# EAGLE design c64switchless_555 (EAGLE 6.0)
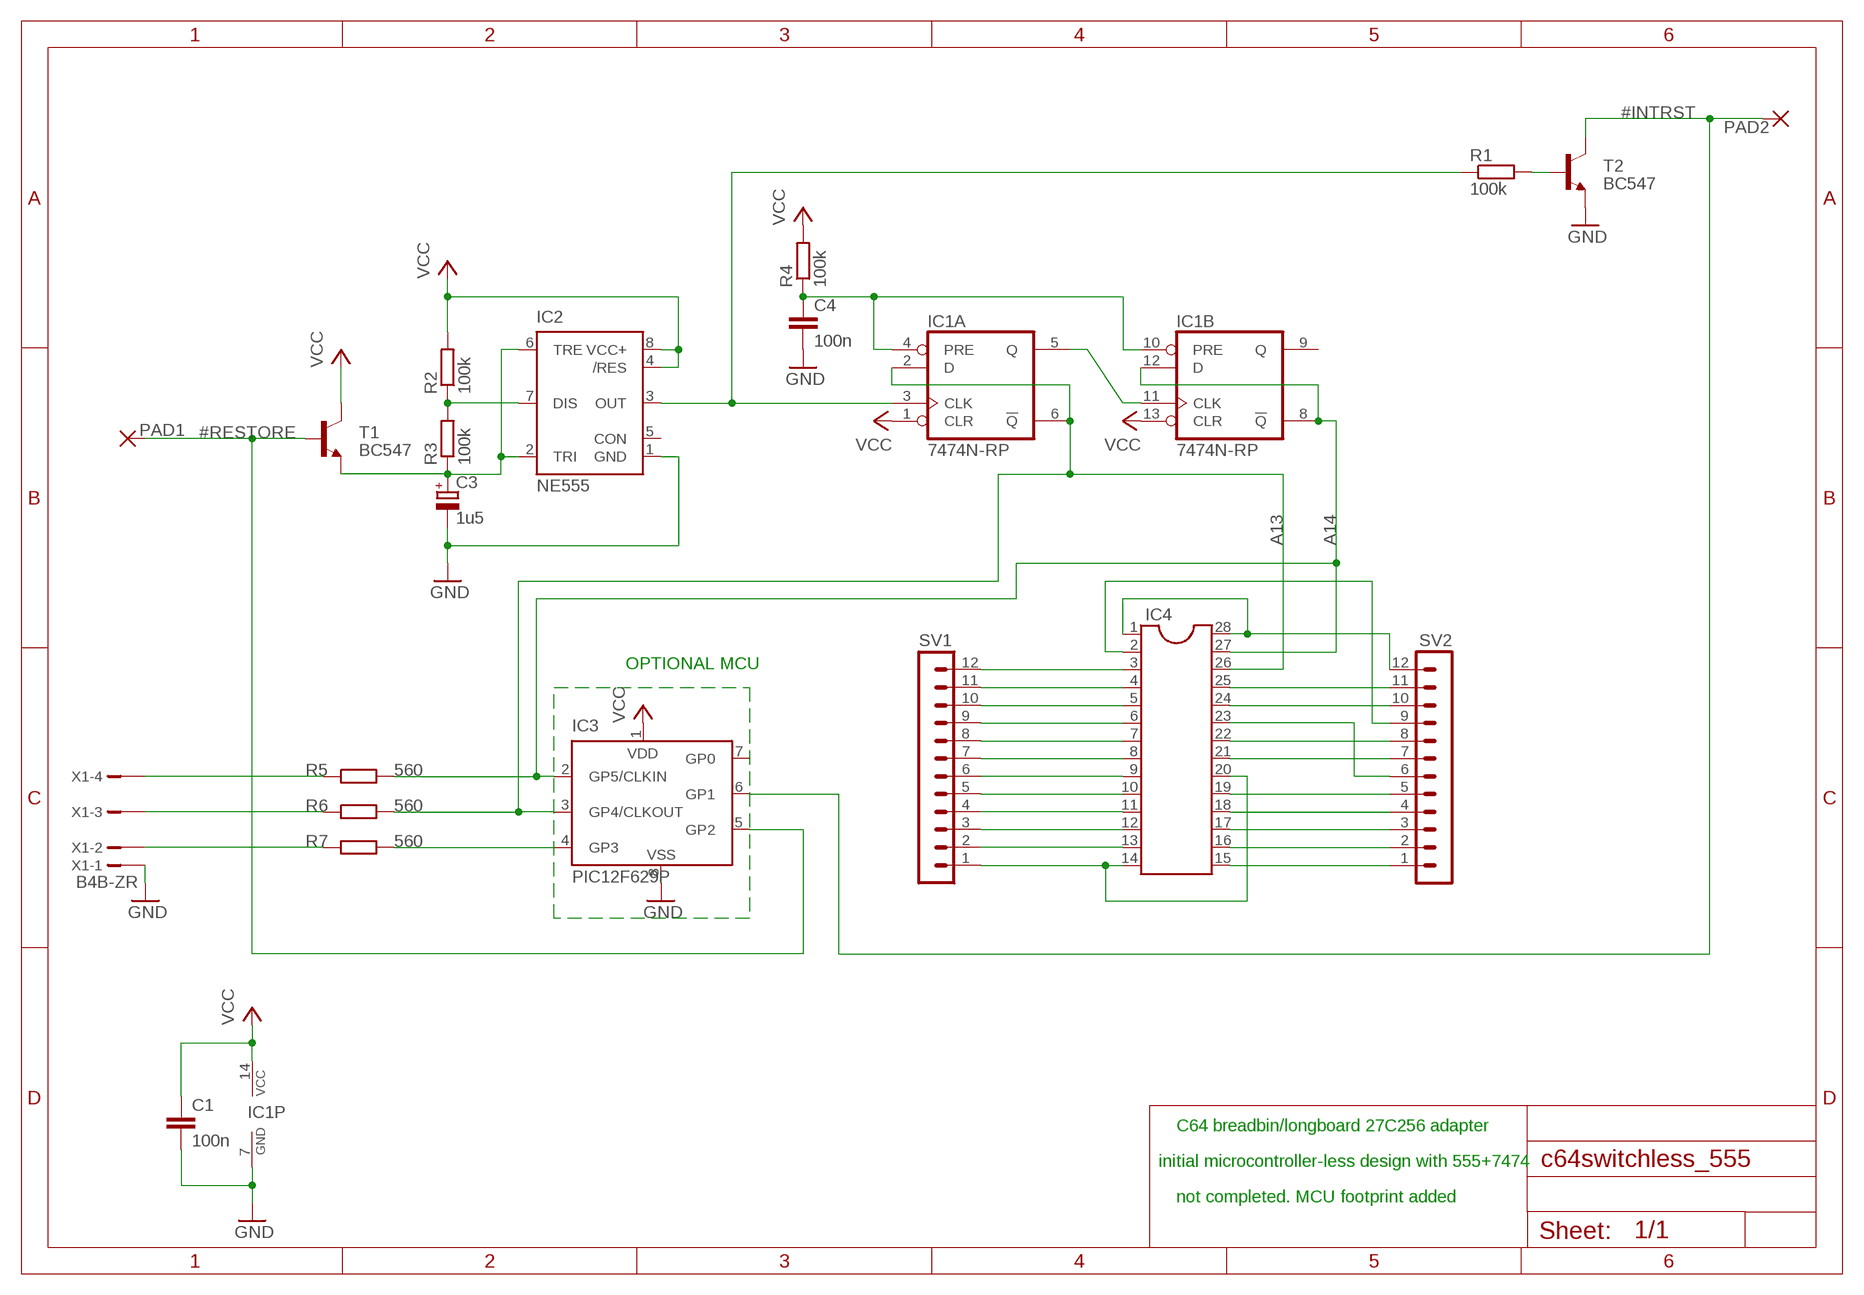
[diagram p0: schematic, sheet 1]

## Parts
C1  100n  C-EU050-030X075  [C050-030X075]
C3  1u5  CPOL-EUE2.5-6  [E2,5-6]
C4  100n  C-EU050-030X075  [C050-030X075]
IC1  7474N-RP  [DIL14-ROUNDPADS]
IC2  NE555  [DIL-08]
IC3  PIC12F629P  [DIL8]
IC4  DIL28ROUND  [DIL28SPECIAL]
PAD1  WIREPAD2,54/1,0  [2,54/1,0]
PAD2  WIREPAD2,54/1,0  [2,54/1,0]
R1  100k  R-EU_0204/7  [0204/7]
R2  100k  R-EU_0204/7  [0204/7]
R3  100k  R-EU_0204/7  [0204/7]
R4  100k  R-EU_0204/7  [0204/7]
R5  560  R-EU_0204/7  [0204/7]
R6  560  R-EU_0204/7  [0204/7]
R7  560  R-EU_0204/7  [0204/7]
SV1  MA12-1ROUND  [MA12-1ROUND]
SV2  MA12-1ROUND  [MA12-1ROUND]
T1  BC547  [TO92]
T2  BC547  [TO92]
X1  B4B-ZR  [B4B-ZR]

## Nets
#INTRST: IC3.6(GP1) PAD2.1(P) T2.3(C)
#RESTORE: IC3.5(GP2) PAD1.1(P) T1.2(B)
A13: IC1.2(A:D) IC1.6(A:!Q) IC3.3(GP4/CLKOUT) IC4.26 R6.2
A14: IC1.8(B:!Q) IC1.12(B:D) IC3.2(GP5/CLKIN) IC4.27 R5.2
GND: C1.2 C3.- C4.2 IC1.7(P:GND) IC2.1(GND) IC3.8(VSS) T2.1(E) X1.1
N$1: IC4.14 IC4.20 SV1.1
N$2: IC4.13 SV1.2
N$3: IC4.12 SV1.3
N$4: IC4.11 SV1.4
N$5: IC4.10 SV1.5
N$6: IC4.9 SV1.6
N$7: IC4.8 SV1.7
N$8: IC4.7 SV1.8
N$9: IC4.6 SV1.9
N$10: IC4.5 SV1.10
N$11: IC4.4 SV1.11
N$12: IC4.3 SV1.12
N$13: IC4.15 SV2.1
N$14: IC4.16 SV2.2
N$15: IC4.17 SV2.3
N$16: IC4.18 SV2.4
N$17: IC4.19 SV2.5
N$18: IC4.21 SV2.7
N$19: IC4.22 SV2.8
N$20: IC4.24 SV2.10
N$21: IC4.25 SV2.11
N$22: IC4.1 IC4.28 SV2.12
N$23: IC4.23 SV2.6
N$24: IC4.2 SV2.9
N$25: R1.2 T2.2(B)
N$26: C3.+ IC2.2(TRI) IC2.6(TRE) R3.1 T1.1(E)
N$27: IC2.7(DIS) R2.1 R3.2
N$28: IC3.4(GP3) R7.2
N$29: IC1.5(A:Q) IC1.11(B:CLK)
N$31: C4.1 IC1.4(A:PRE) IC1.10(B:PRE) R4.1
N$32: R5.1 X1.4
N$33: R6.1 X1.3
N$34: R7.1 X1.2
N$35: IC1.3(A:CLK) IC2.3(OUT) R1.1
VCC: C1.1 IC1.1(A:CLR) IC1.13(B:CLR) IC1.14(P:VCC) IC2.4(/RES) IC2.8(VCC+) IC3.1(VDD) R2.2 R4.2 T1.3(C)
Unconnected: IC1.9(B:Q) IC2.5(CON) IC3.7(GP0)

## Notes on the sheet
- OPTIONAL MCU
- C64 breadbin/longboard 27C256 adapter
- initial microcontroller-less design with 555+7474
- not completed. MCU footprint added

## Library data of the parts
C1 C4 = rcl:C-EU: CAPACITOR, European symbol
C3 = rcl:CPOL-EU: POLARIZED CAPACITOR, European symbol
IC1 = 74xx-eu:74*74: Dual D type positive edge triggered FLIP FLOP, preset and clear
IC2 = st-microelectronics:NE555: General purpose bipolar Timer; MF: Arrow Electronics; MPN: NE555N; OC_FARNELL: 1467742; OC_NEWARK: 89K1486
IC3 = microchip:PIC12F6*: Data Sheet 8-Pin FLASH-Based 8-Bit CMOS Microcontrollers Source: http://www.microchip.com .. 41190c.pdf; MF: MICROCHIP; MPN: PIC12F629-I/P; OC_FARNELL: 1292253; OC_NEWARK: 67K0822
IC4 = ic-package_edit:DIL28: Dual In Line
PAD1 PAD2 = wirepad:WIREPAD: Wire PAD connect wire on PCB
R1-R7 = rcl:R-EU_: RESISTOR, European symbol
SV1 SV2 = con-lstb:MA12-1: PIN HEADER
T1 T2 = transistor:BC547: NPN TRANSISTOR
X1 = con-jst:?4B-ZR: ZH CONNECTOR 1.5 mm, 4 pin 1 row Source: http://www.jst.com .. eZH.pdf; MF: FARNELL; MPN: B4B-ZR(LF)(SN); OC_FARNELL: 1830916; OC_NEWARK: 37K9960

## Board
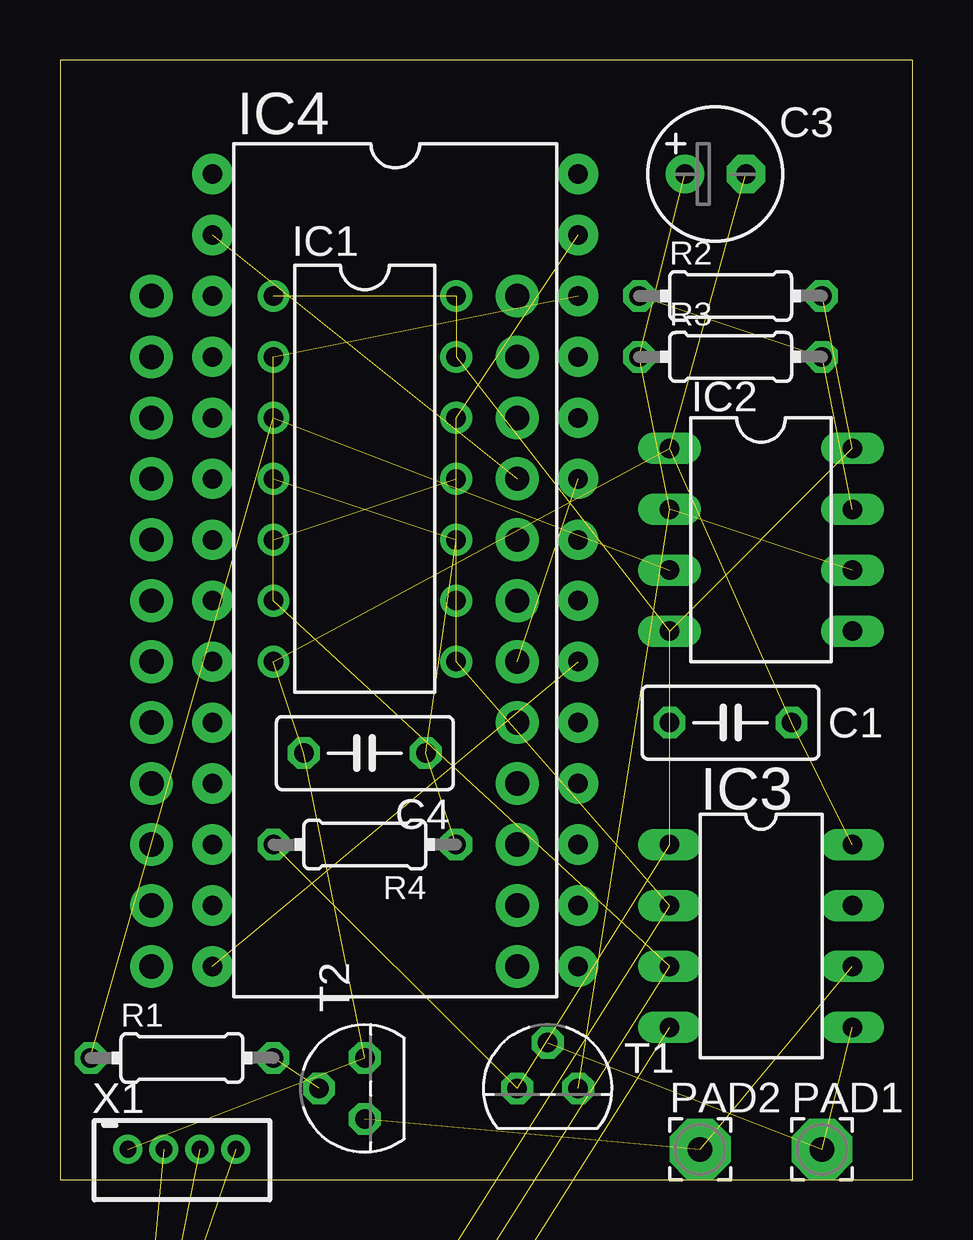
[diagram p1: board, top side]
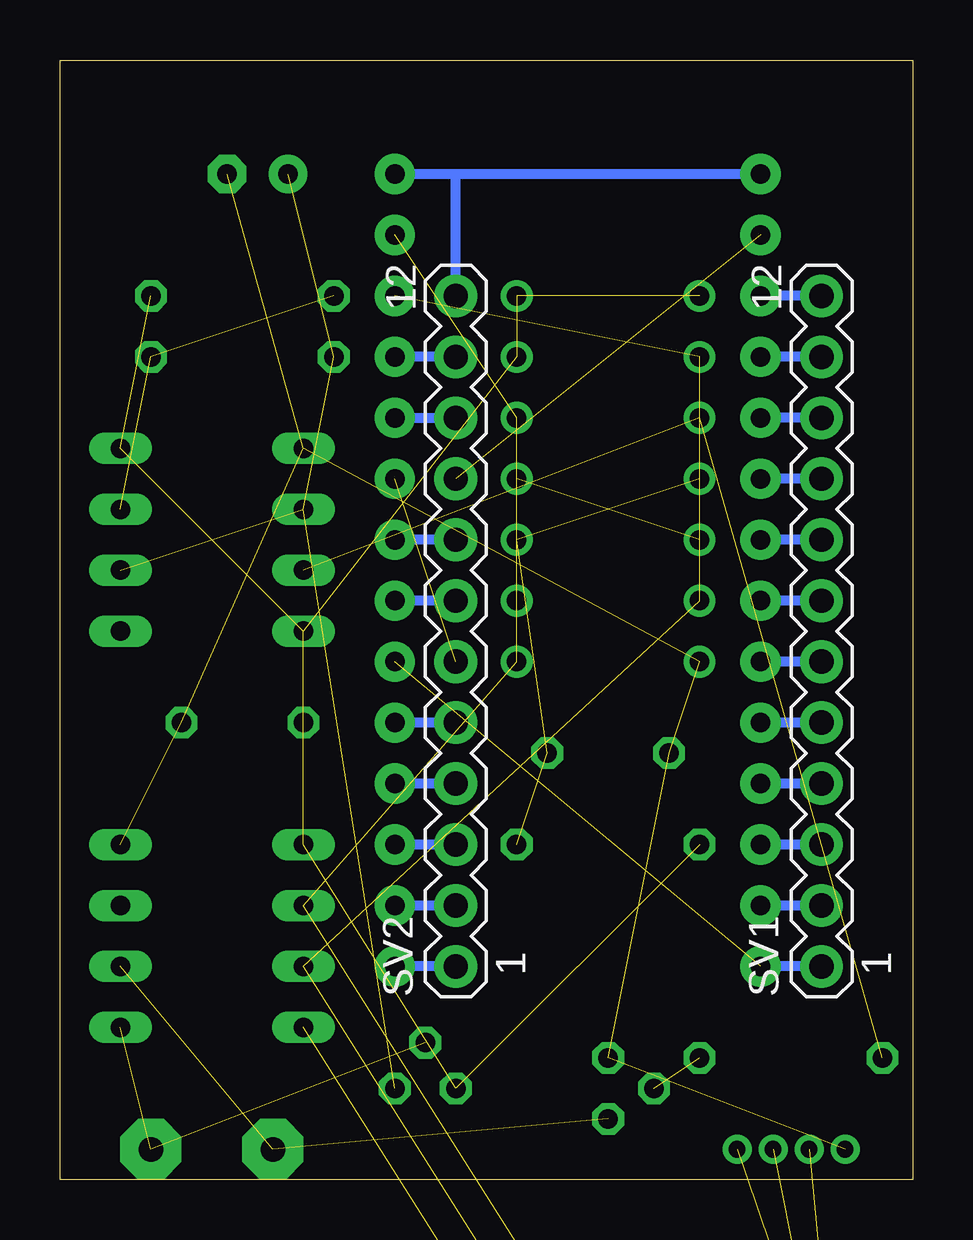
[diagram p2: board, bottom side, seen from below]

Size 35.54 x 46.66 mm. Coordinates in mm from the lower left corner, seen from the top.
Outline: 0,0 35.54,0 35.54,46.66 0,46.66 0,0
Copper layers (1*16): Top 0.035mm / dielectric 1.5mm / Bottom 0.035mm
Design rules: minimum track width 10mil, minimum drill 24mil, track to track 8mil, track to pad 8mil, pad to pad 8mil, via to via 8mil, smd to smd 8mil, copper to edge 40mil, drill to drill 8mil, minimum pad ring 10mil, minimum via ring 8mil, stop-mask expansion 4mil, vias tented up to drill 0mil, thermal gap 10mil

### Footprints (pad centres in the part's own frame; a part is rotated, then mirrored left to right if it is on the bottom)
C050-030X075 = drill 0.813 octagon: 1 -2.54,0; 2 2.54,0
E2,5-6 = drill 0.813 pad 1.6: + -1.27,0 | drill 0.813 pad 1.6 octagon: - 1.27,0
DIL14-ROUNDPADS = drill 0.813: 1 -7.62,-3.81; 2 -5.08,-3.81; 3 -2.54,-3.81; 4 0,-3.81; 5 2.54,-3.81; 6 5.08,-3.81; 7 7.62,-3.81; 8 7.62,3.81; 9 5.08,3.81; 10 2.54,3.81; 11 0,3.81; 12 -2.54,3.81; 13 -5.08,3.81; 14 -7.62,3.81
DIL-08 = drill 0.813 long: 1 -3.81,-3.81; 2 -1.27,-3.81; 3 1.27,-3.81; 4 3.81,-3.81; 5 3.81,3.81; 6 1.27,3.81; 7 -1.27,3.81; 8 -3.81,3.81
DIL8 = drill 0.813 long: 1 -3.81,-3.81; 2 -1.27,-3.81; 3 1.27,-3.81; 4 3.81,-3.81; 5 3.81,3.81; 6 1.27,3.81; 7 -1.27,3.81; 8 -3.81,3.81
DIL28SPECIAL = drill 0.813 pad 1.676: 1 -16.51,-7.62; 2 -13.97,-7.62; 3 -11.43,-7.62; 4 -8.89,-7.62; 5 -6.35,-7.62; 6 -3.81,-7.62; 7 -1.27,-7.62; 8 1.27,-7.62; 9 3.81,-7.62; 10 6.35,-7.62; 11 8.89,-7.62; 12 11.43,-7.62; 13 13.97,-7.62; 14 16.51,-7.62; 15 16.51,7.62; 16 13.97,7.62; 17 11.43,7.62; 18 8.89,7.62; 19 6.35,7.62; 20 3.81,7.62; 21 1.27,7.62; 22 -1.27,7.62; 23 -3.81,7.62; 24 -6.35,7.62; 25 -8.89,7.62; 26 -11.43,7.62; 27 -13.97,7.62; 28 -16.51,7.62
2,54/1,0 = drill 1.016 pad 2.54 octagon: 1 0,0
0204/7 = drill 0.813 octagon: 1 -3.81,0; 2 3.81,0
MA12-1ROUND = drill 1.016 pad 1.778: 1 -13.97,0; 2 -11.43,0; 3 -8.89,0; 4 -6.35,0; 5 -3.81,0; 6 -1.27,0; 7 1.27,0; 8 3.81,0; 9 6.35,0; 10 8.89,0; 11 11.43,0; 12 13.97,0
TO92 = drill 0.813 octagon: 1 1.27,0; 2 0,1.905; 3 -1.27,0
B4B-ZR = drill 0.7 pad 1.1: 1 -2.25,0; 2 -0.75,0; 3 0.75,0; 4 2.25,0

### Placement (x,y rotation side)
C1  27.94,19.05 0 top
C3  27.3,41.91 0 top
C4  12.7,17.78 180 top
IC1  12.7,29.21 270 top
IC2  29.21,26.67 270 top
IC3  29.21,10.16 270 top
IC4  13.97,25.4 270 top
PAD1  31.75,1.27 0 top
PAD2  26.67,1.27 0 top
R1  5.08,5.08 0 top
R2  27.94,36.83 0 top
R3  27.94,34.29 0 top
R4  12.7,13.97 180 top
R5  6.35,-12.7 0 top  (outside the outline)
R6  6.35,-15.24 0 top  (outside the outline)
R7  6.35,-17.78 0 top  (outside the outline)
SV1  3.81,22.86 90 bottom
SV2  19.05,22.86 90 bottom
T1  20.32,3.81 0 top
T2  12.7,3.81 90 top
X1  5.08,1.27 0 top

### Tracks (layer width: path | path; a pad name or v marks a point on that pad's centre or on a via)
#INTRST  (2 unrouted)
#RESTORE  (2 unrouted)
A13  (4 unrouted)
A14  (4 unrouted)
GND  (7 unrouted)
N$1  (1 unrouted)
  Bottom 0.406: SV1.1 IC4.14
N$2
  Bottom 0.406: SV1.2 IC4.13
N$3
  Bottom 0.406: SV1.3 IC4.12
N$4
  Bottom 0.406: SV1.4 IC4.11
N$5
  Bottom 0.406: SV1.5 IC4.10
N$6
  Bottom 0.406: SV1.6 IC4.9
N$7
  Bottom 0.406: SV1.7 IC4.8
N$8
  Bottom 0.406: SV1.8 IC4.7
N$9
  Bottom 0.406: SV1.9 IC4.6
N$10
  Bottom 0.406: SV1.10 IC4.5
N$11
  Bottom 0.406: SV1.11 IC4.4
N$12
  Bottom 0.406: SV1.12 IC4.3
N$13
  Bottom 0.406: SV2.1 IC4.15
N$14
  Bottom 0.406: SV2.2 IC4.16
N$15
  Bottom 0.406: SV2.3 IC4.17
N$16
  Bottom 0.406: SV2.4 IC4.18
N$17
  Bottom 0.406: SV2.5 IC4.19
N$18
  Bottom 0.406: SV2.7 IC4.21
N$19
  Bottom 0.406: SV2.8 IC4.22
N$20
  Bottom 0.406: IC4.24 SV2.10
N$21
  Bottom 0.406: SV2.11 IC4.25
N$22
  Bottom 0.406: IC4.1 19.05,41.91 | 19.05,41.91 IC4.28 | SV2.12 19.05,41.91
N$23  (1 unrouted)
N$24  (1 unrouted)
N$25  (1 unrouted)
N$26  (4 unrouted)
N$27  (2 unrouted)
N$28  (1 unrouted)
N$29  (1 unrouted)
N$31  (3 unrouted)
N$32  (1 unrouted)
N$33  (1 unrouted)
N$34  (1 unrouted)
N$35  (2 unrouted)
VCC  (9 unrouted)